# EAGLE design gateway (EAGLE 4.16)
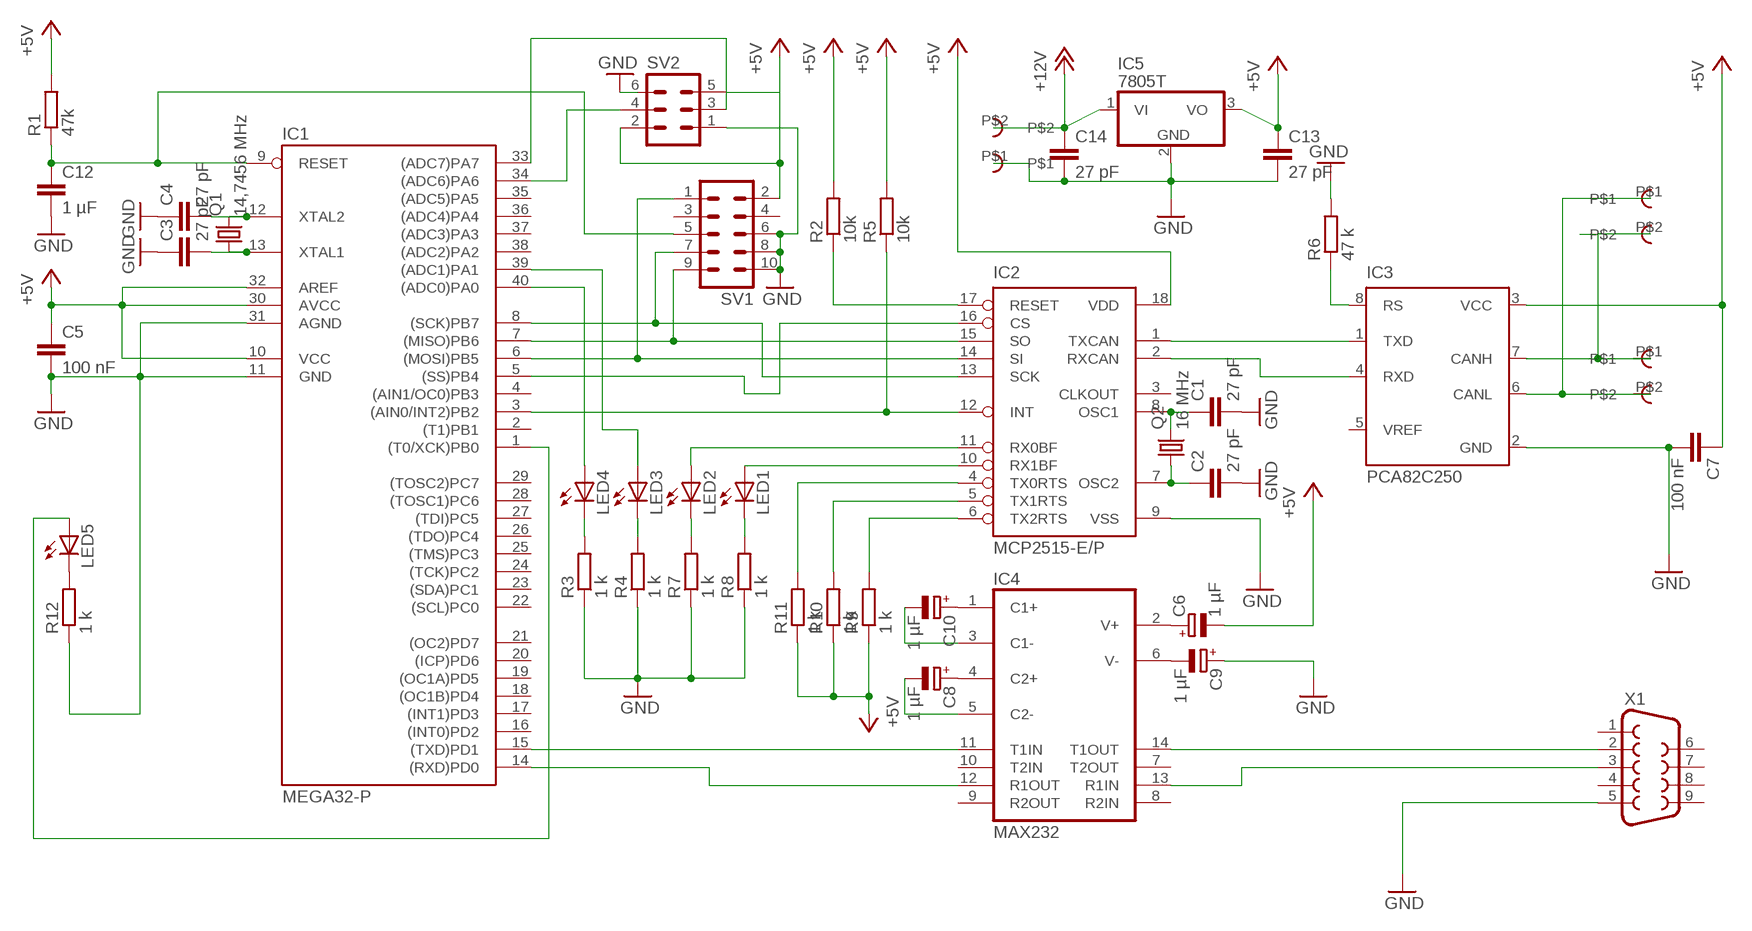
[diagram p0: schematic, sheet 1]

## Parts
C1  27 pF  C-EU025-024X044  [C025-024X044]
C2  27 pF  C-EU025-024X044  [C025-024X044]
C3  27 pF  C-EU025-024X044  [C025-024X044]
C4  27 pF  C-EU025-024X044  [C025-024X044]
C5  100 nF  C-EU025-024X044  [C025-024X044]
C6  1 µF  CPOL-EUE2.5-5  [E2,5-5]
C7  100 nF  C-EU025-024X044  [C025-024X044]
C8  1 µF  CPOL-EUE2.5-5  [E2,5-5]
C9  1 µF  CPOL-EUE2.5-5  [E2,5-5]
C10  1 µF  CPOL-EUE2.5-5  [E2,5-5]
C12  1 µF  C-EU025-024X044  [C025-024X044]
C13  27 pF  C-EU025-024X044  [C025-024X044]
C14  27 pF  C-EU025-024X044  [C025-024X044]
IC1  MEGA32-P  [DIL40]
IC2  MCP2515-E/P  [DIL18]
IC3  PCA82C250  [DIL08]
IC4  MAX232  [DIL16]
IC5  7805T  [TO220H]
LED1  LED3MM  [LED3MM]
LED2  LED3MM  [LED3MM]
LED3  LED3MM  [LED3MM]
LED4  LED3MM  [LED3MM]
LED5  LED3MM  [LED3MM]
Q1  14,7456 MHz  CRYTALHC49S  [HC49/S]
Q2  16 MHz  CRYTALHC49S  [HC49/S]
R1  47k  R-EU_0204/2V  [0204V]
R2  10k  R-EU_0204/2V  [0204V]
R3  1 k  R-EU_0204/2V  [0204V]
R4  1 k  R-EU_0204/2V  [0204V]
R5  10k  R-EU_0204/2V  [0204V]
R6  47 k  R-EU_0204/2V  [0204V]
R7  1 k  R-EU_0204/2V  [0204V]
R8  1 k  R-EU_0204/2V  [0204V]
R9  1 k  R-EU_0204/2V  [0204V]
R10  1 k  R-EU_0204/2V  [0204V]
R11  1 k  R-EU_0204/2V  [0204V]
R12  1 k  R-EU_0204/2V  [0204V]
SV1  ML10  [ML10]
SV2  ML6  [ML6]
U$1  RIACON101-2  [RIACON101-2]
U$2  RIACON101-2  [RIACON101-2]
U$3  RIACON101-2  [RIACON101-2]
X1  F09D  [F09D]

## Nets
+5V: C5.1 C6.- C7.1 C13.1 IC1.10(VCC) IC1.30(AVCC) IC1.32(AREF) IC2.18(VDD) IC3.3(VCC) IC5.3(VO) R1.2 R2.2 R5.2 R9.1 R10.1 R11.1 SV1.2 SV2.2 SV2.5
+12V: C14.1 IC5.1(VI) U$3.P$2
GND: C1.2 C2.2 C3.1 C4.1 C5.2 C7.2 C9.+ C12.2 C13.2 C14.2 IC1.11(GND) IC1.31(AGND) IC2.9(VSS) IC3.2(GND) IC5.2(GND) R3.1 R4.1 R6.2 R7.1 R8.1 R12.1 SV1.6 SV1.8 SV1.10 SV2.1 SV2.6 U$3.P$1 X1.5
N$1: IC1.5((SS)PB4) IC2.16(CS)
N$2: IC1.7((MISO)PB6) IC2.15(SO) SV1.9
N$3: IC1.6((MOSI)PB5) IC2.14(SI) SV1.1
N$4: IC1.3((AIN0/INT2)PB2) IC2.12(INT) R5.1
N$5: IC1.8((SCK)PB7) IC2.13(SCK) SV1.7
N$6: IC2.1(TXCAN) IC3.1(TXD)
N$7: IC2.2(RXCAN) IC3.4(RXD)
N$8: IC1.15((TXD)PD1) IC4.11(T1IN)
N$9: IC1.14((RXD)PD0) IC4.12(R1OUT)
N$10: C3.2 IC1.13(XTAL1) Q1.1
N$11: C4.2 IC1.12(XTAL2) Q1.2
N$12: C1.1 IC2.8(OSC1) Q2.2
N$13: C2.1 IC2.7(OSC2) Q2.1
N$14: IC4.14(T1OUT) X1.2
N$15: IC4.13(R1IN) X1.3
N$16: IC3.6(CANL) U$1.P$2 U$2.P$1
N$17: IC3.7(CANH) U$1.P$1 U$2.P$2
N$18: C10.+ IC4.1(C1+)
N$19: C8.+ IC4.4(C2+)
N$20: C10.- IC4.3(C1-)
N$21: C8.- IC4.5(C2-)
N$22: C9.- IC4.6(V-)
N$23: C6.+ IC4.2(V+)
N$24: LED3.K(C) R4.2
N$25: LED4.K(C) R3.2
N$26: C12.1 IC1.9(RESET) R1.1 SV1.5
N$27: IC2.17(RESET) R2.1
N$28: IC1.40((ADC0)PA0) LED4.A
N$29: IC3.8(RS) R6.1
N$30: LED2.K(C) R7.2
N$31: IC1.39((ADC1)PA1) LED3.A
N$32: LED1.K(C) R8.2
N$33: IC2.10(RX1BF) LED1.A
N$34: IC2.11(RX0BF) LED2.A
N$35: IC2.6(TX2RTS) R9.2
N$36: IC2.5(TX1RTS) R10.2
N$37: IC2.4(TX0RTS) R11.2
N$38: LED5.K(C) R12.2
N$39: IC1.34((ADC6)PA6) SV2.4
N$40: IC1.1((T0/XCK)PB0) LED5.A
N$41: IC1.33((ADC7)PA7) SV2.3
Unconnected: IC1.2((T1)PB1) IC1.4((AIN1/OC0)PB3) IC1.16((INT0)PD2) IC1.17((INT1)PD3) IC1.18((OC1B)PD4) IC1.19((OC1A)PD5) IC1.20((ICP)PD6) IC1.21((OC2)PD7) IC1.22((SCL)PC0) IC1.23((SDA)PC1) IC1.24((TCK)PC2) IC1.25((TMS)PC3) IC1.26((TDO)PC4) IC1.27((TDI)PC5) IC1.28((TOSC1)PC6) IC1.29((TOSC2)PC7) IC1.35((ADC5)PA5) IC1.36((ADC4)PA4) IC1.37((ADC3)PA3) IC1.38((ADC2)PA2) IC2.3(CLKOUT) IC3.5(VREF) IC4.7(T2OUT) IC4.8(R2IN) IC4.9(R2OUT) IC4.10(T2IN) SV1.3 SV1.4 X1.1 X1.4 X1.6 X1.7 X1.8 X1.9

## Power pins joined to a net without a drawn wire
GND: IC4.15(GND)
VCC: IC4.16(VCC)

## Library data of the parts
C1-C5 C7 C12-C14 = rcl:C-EU: CAPACITOR, European symbol
C6 C8-C10 = rcl:CPOL-EU: POLARIZED CAPACITOR, European symbol
IC1 = atmel:MEGA32-P: MICROCONTROLLER 32 Kbytes FLASH 2 Kbytes SRAM 1 Kbytes EEPROM USART 8-channel 10 bit ADC Source: www.atmel.com .. doc2503.pdf
IC2 = mcp2515:MCP2515
IC3 = micro-philips:PCA82C250: CAN CONTROLLER INTERFACE
IC4 = maxim:MAX232: RS232 TRANSEIVER
IC5 = linear:78*: Positive VOLTAGE REGULATOR Source: http://cache.national.com/ds/LM/LM78L05.pdf http://www.fairchildsemi.com/ds/LM/LM7805.pdf
LED1-LED5 = led:LED: LED OSRAM: - CHIPLED LG R971, LG N971, LY N971, LG Q971, LY Q971, LO R971, LY R971 LH N974, LH R974 LS Q976, LO Q976, LY Q976 LO Q996 - Hyper CHIPLED LW Q18S LB Q993, LB Q99A, LB R99A - SideLED LS A670, LO A670, LY A670, LG A670, LP A670 LB A673, LV A673, LT A673, LW A673 LH A674 LY A675 LS A676, LA A676, LO A676, LY A676, LW A676 LS A679, LY A679, LG A679 - Hyper Micro SIDELED® LS Y876, LA Y876, LO Y876, LY Y876 LT Y87S - SmartLED LW L88C, LW L88S LB L89C, LB L89S, LG L890 LS L89K, LO L89K, LY L89K LS L896, LA L896, LO L896, LY L896 - TOPLED LS T670, LO T670, LY T670, LG T670, LP T670 LSG T670, LSP T670, LSY T670, LOP T670, LYG T670 LG T671, LOG T671, LSG T671 LB T673, LV T673, LT T673, LW T673 LH T674 LS T676, LA T676, LO T676, LY T676, LB T676, LH T676, LSB T676, LW T676 LB T67C, LV T67C, LT T67C, LS T67K, LO T67K, LY T67K, LW E67C LS E67B, LA E67B, LO E67B, LY E67B, LB E67C, LV E67C, LT E67C LW T67C LS T679, LY T679, LG T679 LS T770, LO T770, LY T770, LG T770, LP T770 LB T773, LV T773, LT T773, LW T773 LH T774 LS E675, LA E675, LY E675, LS T675 LS T776, LA T776, LO T776, LY T776, LB T776 LHGB T686 LT T68C, LB T68C - Hyper Mini TOPLED® LB M676 - Mini TOPLED Santana® LG M470 LS M47K, LO M47K, LY M47K Source: http://www.osram.convergy.de - LUMILED® LXK2-PW12-R00, LXK2-PW12-S00, LXK2-PW14-U00, LXK2-PW14-V00 LXK2-PM12-R00, LXK2-PM12-S00, LXK2-PM14-U00 LXK2-PE12-Q00, LXK2-PE12-R00, LXK2-PE12-S00, LXK2-PE14-T00, LXK2-PE14-U00 LXK2-PB12-K00, LXK2-PB12-L00, LXK2-PB12-M00, LXK2-PB14-N00, LXK2-PB14-P00, LXK2-PB14-Q00 LXK2-PR12-L00, LXK2-PR12-M00, LXK2-PR14-Q00, LXK2-PR14-R00 LXK2-PD12-Q00, LXK2-PD12-R00, LXK2-PD12-S00 LXK2-PH12-R00, LXK2-PH12-S00 LXK2-PL12-P00, LXK2-PL12-Q00, LXK2-PL12-R00 Source: www.luxeon.com
Q1 Q2 = crystal:CRYTAL: CRYSTAL
R1-R12 = rcl:R-EU_: RESISTOR, European symbol
SV1 = con-harting-ml:ML10: HARTING
SV2 = con-harting-ml:ML6: HARTING
U$1-U$3 = con-riacon101:RIACON101-2: Riaconn Schreaubklemme 101
X1 = con-subd:F09: SUB-D

## Board
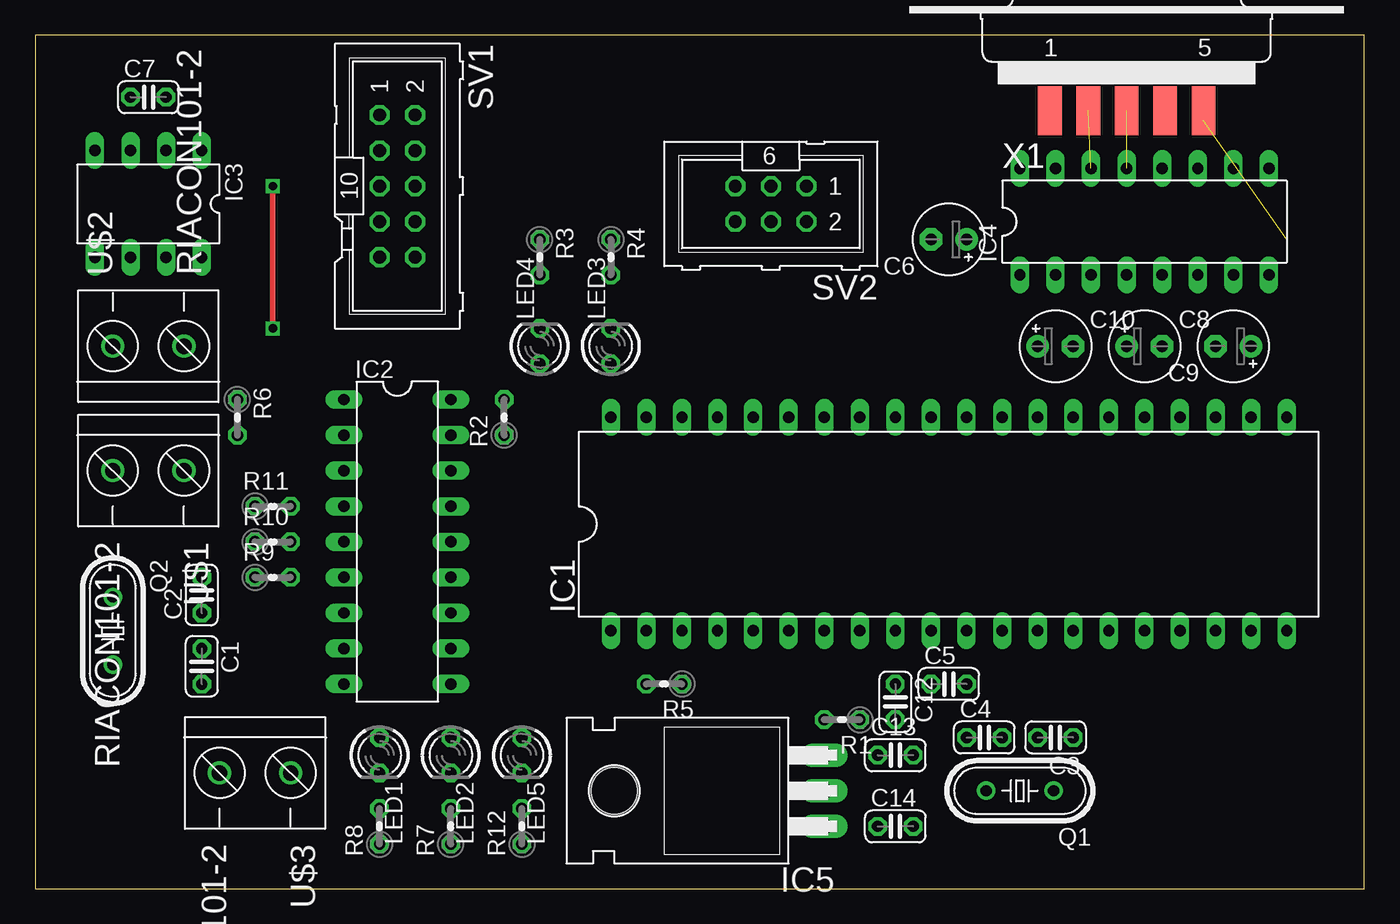
[diagram p1: board, top side]
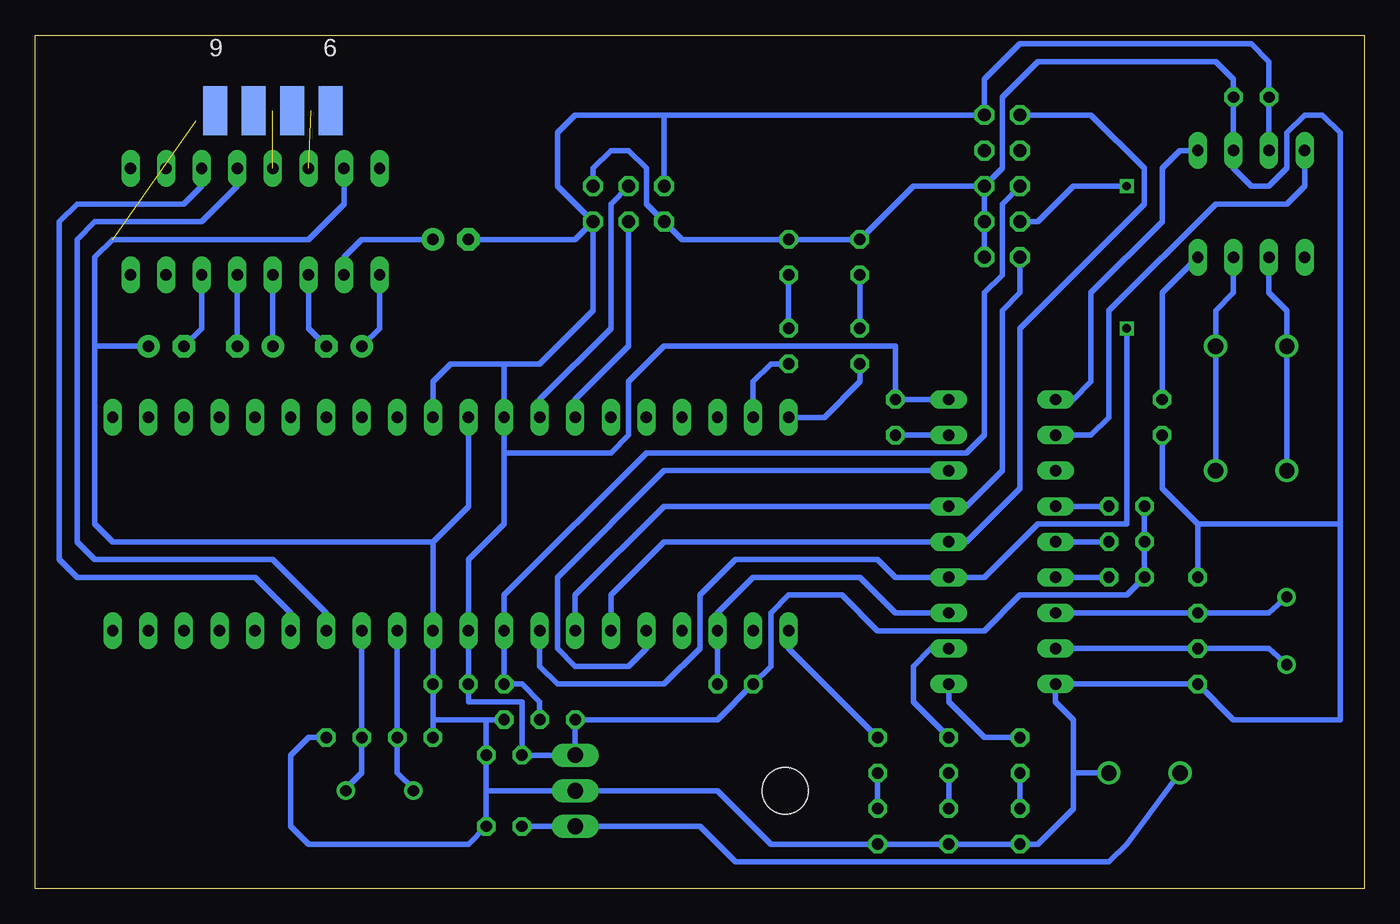
[diagram p2: board, bottom side, seen from below]

Size 94.92 x 60.95 mm. Coordinates in mm from the lower left corner, seen from the top.
Outline: 0,0 94.92,0 94.92,60.95 0,60.95 0,0
Copper layers (1*16): Top 0.035mm / dielectric 1.5mm / Bottom 0.035mm
Design rules "default": minimum track width 10mil, minimum drill 24mil, track to track 8mil, track to pad 8mil, pad to pad 8mil, via to via 8mil, smd to smd 8mil, copper to edge 40mil, drill to drill 8mil, minimum pad ring 10mil, minimum via ring 8mil, stop-mask expansion 4mil, vias tented up to drill 0mil, thermal gap 10mil

### Footprints (pad centres in the part's own frame; a part is rotated, then mirrored left to right if it is on the bottom)
C025-024X044 = drill 0.813 octagon: 1 -1.27,0; 2 1.27,0
E2,5-5 = drill 0.813 pad 1.6 round: + -1.27,0 | drill 0.813 pad 1.6 octagon: - 1.27,0
DIL40 = drill 0.813 long: 1 -24.13,-7.62; 2 -21.59,-7.62; 3 -19.05,-7.62; 4 -16.51,-7.62; 5 -13.97,-7.62; 6 -11.43,-7.62; 7 -8.89,-7.62; 8 -6.35,-7.62; 9 -3.81,-7.62; 10 -1.27,-7.62; 11 1.27,-7.62; 12 3.81,-7.62; 13 6.35,-7.62; 14 8.89,-7.62; 15 11.43,-7.62; 16 13.97,-7.62; 17 16.51,-7.62; 18 19.05,-7.62; 19 21.59,-7.62; 20 24.13,-7.62; 21 24.13,7.62; 22 21.59,7.62; 23 19.05,7.62; 24 16.51,7.62; 25 13.97,7.62; 26 11.43,7.62; 27 8.89,7.62; 28 6.35,7.62; 29 3.81,7.62; 30 1.27,7.62; 31 -1.27,7.62; 32 -3.81,7.62; 33 -6.35,7.62; 34 -8.89,7.62; 35 -11.43,7.62; 36 -13.97,7.62; 37 -16.51,7.62; 38 -19.05,7.62; 39 -21.59,7.62; 40 -24.13,7.62
DIL18 = drill 0.813 long: 1 -10.16,-3.81; 2 -7.62,-3.81; 3 -5.08,-3.81; 4 -2.54,-3.81; 5 0,-3.81; 6 2.54,-3.81; 7 5.08,-3.81; 8 7.62,-3.81; 9 10.16,-3.81; 10 10.16,3.81; 11 7.62,3.81; 12 5.08,3.81; 13 2.54,3.81; 14 0,3.81; 15 -2.54,3.81; 16 -5.08,3.81; 17 -7.62,3.81; 18 -10.16,3.81
DIL08 = drill 0.813 long: 1 -3.81,-3.81; 2 -1.27,-3.81; 3 1.27,-3.81; 4 3.81,-3.81; 5 3.81,3.81; 6 1.27,3.81; 7 -1.27,3.81; 8 -3.81,3.81
DIL16 = drill 0.813 long: 1 -8.89,-3.81; 2 -6.35,-3.81; 3 -3.81,-3.81; 4 -1.27,-3.81; 5 1.27,-3.81; 6 3.81,-3.81; 7 6.35,-3.81; 8 8.89,-3.81; 9 8.89,3.81; 10 6.35,3.81; 11 3.81,3.81; 12 1.27,3.81; 13 -1.27,3.81; 14 -3.81,3.81; 15 -6.35,3.81; 16 -8.89,3.81
TO220H = drill 1.118 long: 1 -2.54,-10.16; 2 0,-10.16; 3 2.54,-10.16 | hole 3.302: 0,4.826
LED3MM = drill 0.813 octagon: A -1.27,0; K 1.27,0
HC49/S = drill 0.813 round: 1 -2.413,0; 2 2.413,0
0204V = drill 0.813 octagon: 1 -1.27,0; 2 1.27,0
ML10 = drill 0.914 octagon: 1 -5.08,-1.27; 2 -5.08,1.27; 3 -2.54,-1.27; 4 -2.54,1.27; 5 0,-1.27; 6 0,1.27; 7 2.54,-1.27; 8 2.54,1.27; 9 5.08,-1.27; 10 5.08,1.27
ML6 = drill 0.914 octagon: 1 -2.54,-1.27; 2 -2.54,1.27; 3 0,-1.27; 4 0,1.27; 5 2.54,-1.27; 6 2.54,1.27
RIACON101-2 = drill 1.1 round: P$1 0,2.54; P$2 0,-2.54
F09D = smd 1.7 x 3.5: 1 -5.486,-6.045; 2 -2.743,-6.045; 3 0,-6.045; 4 2.743,-6.045; 5 5.486,-6.045 | smd 1.7 x 3.5 bottom: 6 -4.115,-6.045; 7 -1.372,-6.045; 8 1.372,-6.045; 9 4.115,-6.045

### Placement (x,y rotation side)
C1  11.9,15.87 270 top
C2  11.9,20.95 90 top
C3  72.86,10.79 180 top
C4  67.78,10.79 0 top
C5  65.24,14.6 0 top
C6  65.24,46.35 180 top
C7  8.09,56.51 0 top
C8  79.21,38.73 0 top
C9  85.56,38.73 180 top
C10  72.86,38.73 0 top
C12  61.43,13.33 270 top
C13  61.43,9.52 0 top
C14  61.43,4.44 0 top
IC1  65.24,26.03 0 top
IC2  25.87,24.76 270 top
IC3  8.09,48.89 180 top
IC4  79.21,47.62 0 top
IC5  46.19,6.98 90 top
LED1  24.6,9.52 270 top
LED2  29.68,9.52 270 top
LED3  41.11,38.73 90 top
LED4  36.03,38.73 90 top
LED5  34.76,9.52 270 top
Q1  70.32,6.98 180 top
Q2  5.55,18.41 270 top
R1  57.62,12.06 180 top
R2  33.49,33.65 90 top
R3  36.03,45.08 270 top
R4  41.11,45.08 270 top
R5  44.92,14.6 180 top
R6  14.44,33.65 270 top
R7  29.68,4.44 90 top
R8  24.6,4.44 90 top
R9  16.98,22.22 0 top
R10  16.98,24.76 0 top
R11  16.98,27.3 0 top
R12  34.76,4.44 90 top
SV1  25.87,50.16 270 top
SV2  52.54,48.89 180 top
U$1  8.09,29.84 270 top
U$2  8.09,38.73 90 top
U$3  15.71,8.25 270 top
X1  77.94,61.59 0 top

### Tracks (layer width: path | path; a pad name or v marks a point on that pad's centre or on a via)
+5V
  Bottom 0.406: 61.43,31.11 IC1.32 61.43,37.46 | 61.43,31.11 61.43,26.03 63.97,23.49 IC1.10 C5.1 63.97,13.33 60.16,13.33 C13.1 IC5.3 R1.2 46.19,12.06 R5.2 42.38,15.87 42.38,19.68 41.11,20.95 37.3,20.95 34.76,18.41 27.14,18.41 24.6,20.95 16.98,20.95 R9.1 | IC2.18 R2.2 33.49,38.73 50,38.73 52.54,36.19 52.54,32.38 53.81,31.11 61.43,31.11 | R9.1 R10.1 R11.1 R9.1 | IC3.3 C7.1 6.82,59.05 8.09,60.32 24.6,60.32 27.14,57.78 SV1.2 50,55.24 | IC1.30 66.51,36.19 65.24,37.46 61.43,37.46 | SV2.2 55.08,41.27 58.89,37.46 61.43,37.46 | 50,55.24 SV2.5 | 50,55.24 56.35,55.24 57.62,53.97 57.62,50.16 SV2.2 | C6.- 56.35,46.35 SV2.2
+12V
  Bottom 0.406: U$3.P$2 16.98,3.17 18.25,1.9 44.92,1.9 47.46,4.44 IC5.1 C14.1
GND  (1 unrouted)
  Top 0.406: X1.5 83.43,54.83
  Bottom 0.406: SV1.10 SV1.8 SV1.6 | 66.51,12.06 C5.2 IC1.11 66.51,24.76 | 20.79,8.25 20.79,12.06 22.06,13.33 IC2.9 C1.2 9.36,12.06 1.74,12.06 1.74,26.03 | 11.9,26.03 C2.2 | 1.74,26.03 1.74,53.97 3.01,55.24 4.28,55.24 5.55,53.97 5.55,51.43 6.82,50.16 8.09,50.16 9.36,51.43 IC3.2 C7.2 9.36,57.78 10.63,59.05 23.33,59.05 25.87,56.51 25.87,51.43 SV1.6 | R6.2 14.44,28.57 11.9,26.03 | 1.74,26.03 11.9,26.03 | 20.79,8.25 U$3.P$1 | 66.51,12.06 C4.1 | C3.1 75.4,10.79 76.67,9.52 76.67,4.44 75.4,3.17 63.97,3.17 C14.2 62.7,6.98 | 20.79,8.25 20.79,5.71 23.33,3.17 R8.1 R7.1 R12.1 42.38,3.17 46.19,6.98 IC5.2 62.7,6.98 | SV1.6 32.22,50.16 R3.1 R4.1 48.73,46.35 SV2.6 51.27,48.89 51.27,51.43 52.54,52.7 53.81,52.7 55.08,51.43 SV2.1 | 62.7,12.06 C12.2 | 62.7,12.06 66.51,12.06 | 62.7,6.98 C13.2 62.7,12.06 | IC1.31 63.97,27.3 66.51,24.76 | 90.64,38.73 C9.+ | IC4.15 72.86,48.89 75.4,46.35 89.37,46.35 90.64,45.08 90.64,38.73 | 90.64,38.73 90.64,26.03 89.37,24.76 66.51,24.76
N$1
  Bottom 0.406: IC1.5 51.27,17.14 52.54,15.87 56.35,15.87 57.62,17.14 57.62,22.22 50,29.84 IC2.16
N$2
  Bottom 0.406: IC1.7 56.35,20.95 50,27.3 IC2.15 28.41,27.3 25.87,29.84 25.87,41.27 24.6,42.54 SV1.9
N$3
  Bottom 0.406: IC1.6 53.81,20.95 50,24.76 IC2.14 28.41,24.76 24.6,28.57 24.6,40 15.71,48.89 15.71,51.43 19.52,55.24 SV1.1
N$4
  Bottom 0.406: R5.1 IC1.3 46.19,19.68 43.65,22.22 36.03,22.22 33.49,19.68 IC2.12
N$5  (via drill 0.6)
  Top 0.406: v16.98,40 v16.98,50.16
  Bottom 0.406: IC1.8 58.89,15.87 57.62,14.6 50,14.6 47.46,17.14 47.46,20.95 44.92,23.49 34.76,23.49 33.49,22.22 IC2.13 27.14,22.22 23.33,26.03 16.98,26.03 v16.98,40 | v16.98,50.16 20.79,50.16 23.33,47.62 SV1.7
N$6
  Bottom 0.406: IC2.1 20.79,34.92 19.52,36.19 19.52,42.54 14.44,47.62 14.44,51.43 13.17,52.7 IC3.1
N$7
  Bottom 0.406: IC2.2 19.52,32.38 18.25,33.65 18.25,41.27 10.63,48.89 5.55,48.89 4.28,50.16 IC3.4
N$8
  Bottom 0.406: IC4.11 83.02,50.16 84.29,48.89 91.91,48.89 93.18,47.62 93.18,23.49 91.91,22.22 79.21,22.22 76.67,19.68 IC1.15
N$9
  Bottom 0.406: IC1.14 74.13,19.68 77.94,23.49 90.64,23.49 91.91,24.76 91.91,46.35 90.64,47.62 83.02,47.62 80.48,50.16 IC4.12
N$10
  Bottom 0.406: IC1.13 C3.2 71.59,8.25 72.73,7.11 Q1.1
N$11
  Bottom 0.406: IC1.12 C4.2 69.05,8.25 67.91,7.11 Q1.2
N$12
  Bottom 0.406: IC2.8 C1.1 6.82,17.14 Q2.2
N$13
  Bottom 0.406: IC2.7 C2.1 6.82,19.68 Q2.1
N$14  (1 unrouted)
N$15  (1 unrouted)
N$16
  Bottom 0.406: U$1.P$2 U$2.P$1 5.55,41.27 6.82,42.54 IC3.6
N$17
  Bottom 0.406: IC3.7 9.36,42.54 10.63,41.27 U$2.P$2 U$1.P$1
N$18
  Bottom 0.406: IC4.1 70.32,40 C10.+
N$19
  Bottom 0.406: IC4.4 C8.+
N$20
  Bottom 0.406: IC4.3 75.4,40 C10.-
N$21
  Bottom 0.406: IC4.5 C8.-
N$22
  Bottom 0.406: IC4.6 83.02,40 C9.-
N$23
  Bottom 0.406: IC4.2 72.86,45.08 71.59,46.35 C6.+
N$24
  Bottom 0.406: LED3.K R4.2
N$25
  Bottom 0.406: LED4.K R3.2
N$26
  Bottom 0.406: R1.1 58.89,13.33 60.16,14.6 C12.1 IC1.9 61.43,20.95 51.27,31.11 28.41,31.11 27.14,32.38 27.14,42.54 25.87,43.81 25.87,48.89 SV1.5
N$27
  Bottom 0.406: IC2.17 R2.1
N$28
  Bottom 0.406: LED4.A 36.03,36.19 38.57,33.65 IC1.40
N$29
  Bottom 0.406: R6.1 14.44,42.54 IC3.8
N$30
  Bottom 0.406: LED2.K R7.2
N$31
  Bottom 0.406: LED3.A 42.38,37.46 43.65,36.19 IC1.39
N$32
  Bottom 0.406: R8.2 LED1.K
N$33
  Bottom 0.406: LED1.A 27.14,10.79 29.68,13.33 IC2.10
N$34
  Bottom 0.406: IC2.11 30.95,17.14 32.22,15.87 32.22,13.33 LED2.A
N$35
  Bottom 0.406: R9.2 IC2.6
N$36
  Bottom 0.406: R10.2 IC2.5
N$37
  Bottom 0.406: R11.2 IC2.4
N$38
  Bottom 0.406: R12.2 LED5.K
N$39
  Bottom 0.406: SV2.4 52.54,38.73 56.35,34.92 IC1.34
N$40
  Bottom 0.406: LED5.A 41.11,17.14 IC1.1
N$41
  Bottom 0.406: IC1.33 58.89,34.92 53.81,40 53.81,48.89 SV2.3